# EAGLE design Adafruit Bluefruit LE UART Friend (EAGLE 6.4)
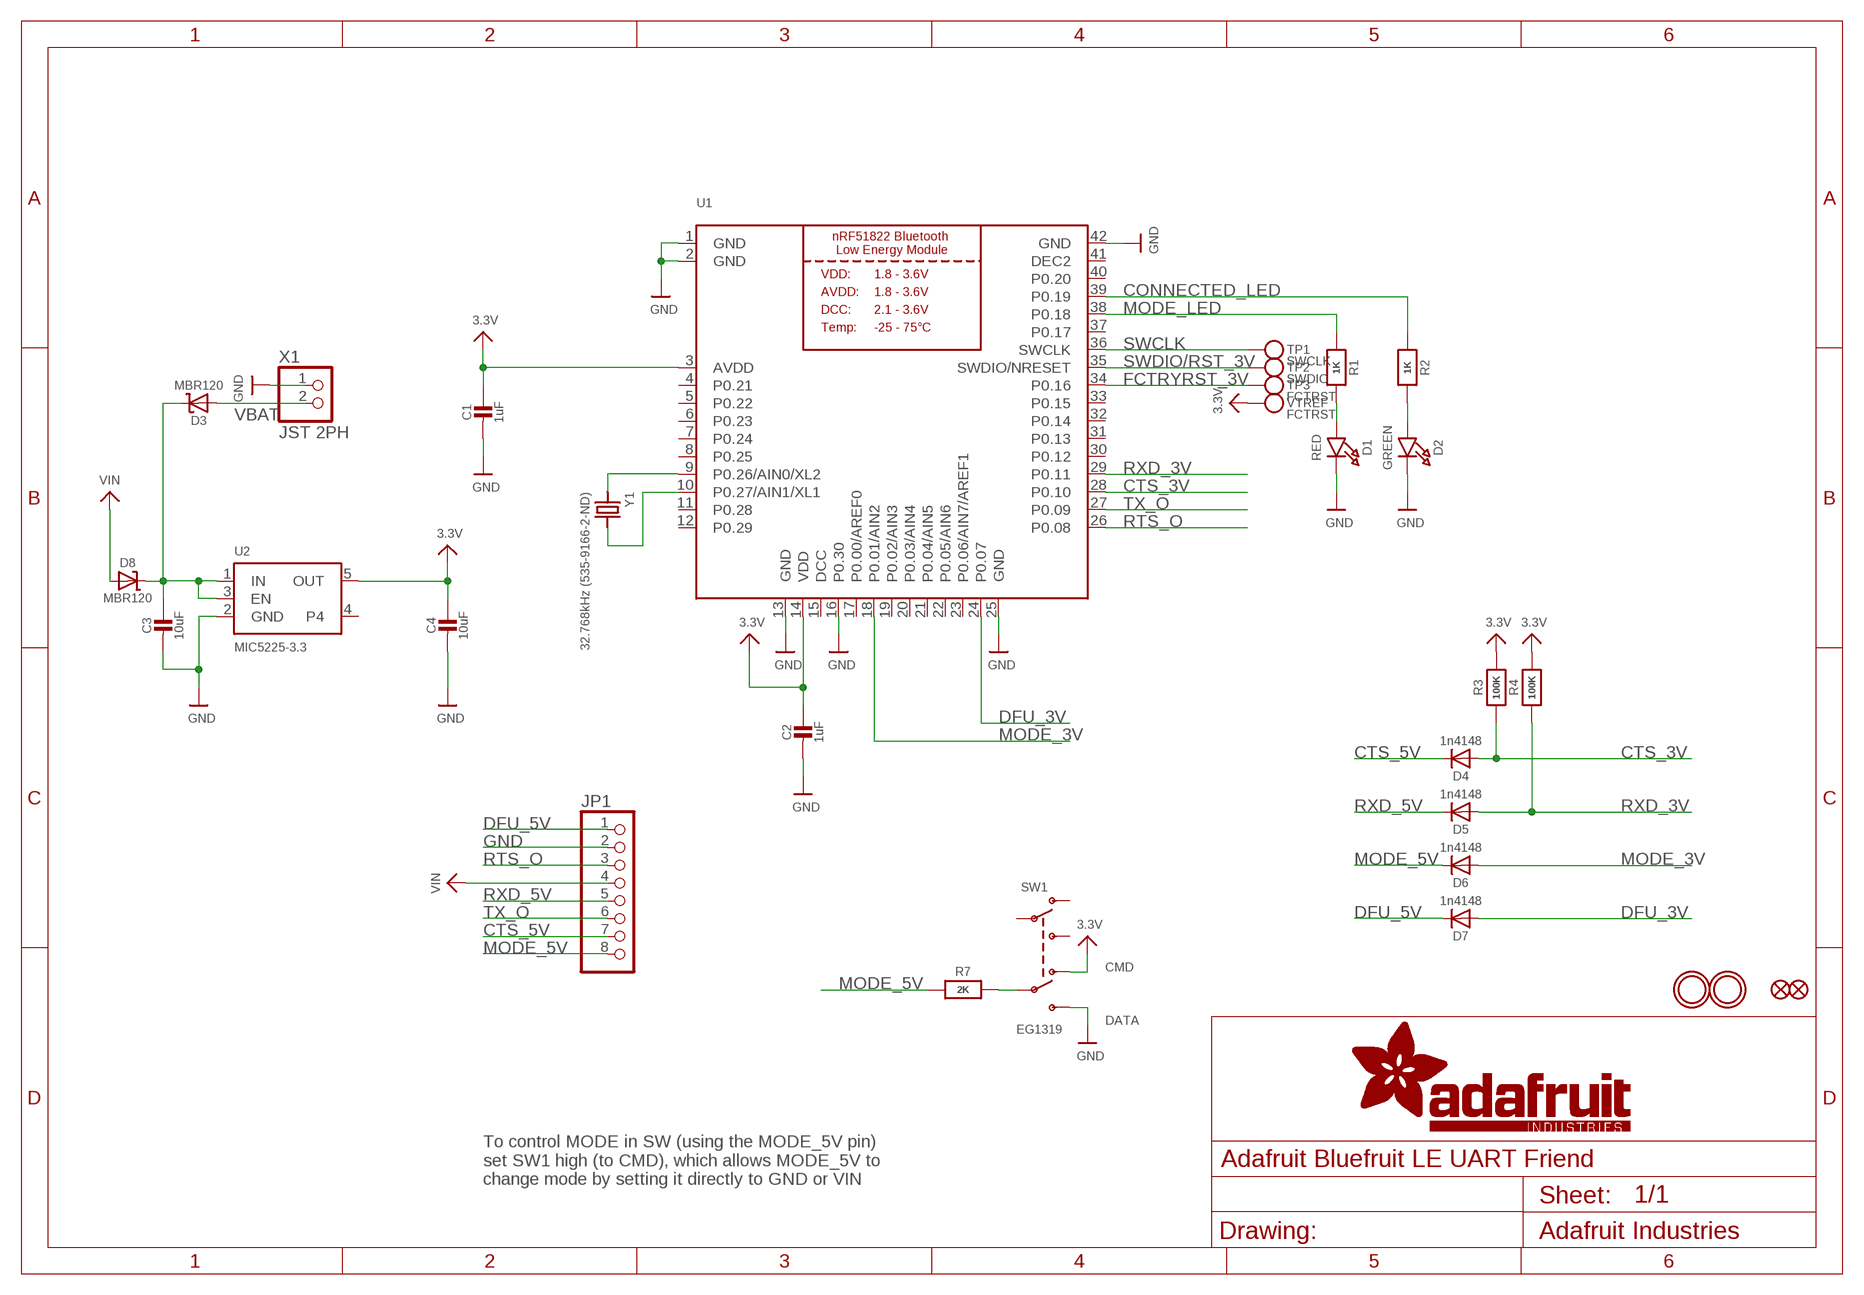
[diagram p0: schematic, sheet 1]

## Parts
C1  1uF  CAP_CERAMIC0805-NOOUTLINE  [0805-NO]
C2  1uF  CAP_CERAMIC0805-NOOUTLINE  [0805-NO]
C3  10uF  CAP_CERAMIC0805-NOOUTLINE  [0805-NO]
C4  10uF  CAP_CERAMIC0805-NOOUTLINE  [0805-NO]
D1  RED  LED0805_NOOUTLINE  [CHIPLED_0805_NOOUTLINE]
D2  GREEN  LED0805_NOOUTLINE  [CHIPLED_0805_NOOUTLINE]
D3  MBR120  DIODE-SCHOTTKYSOD-123  [SOD-123]
D4  1n4148  DIODESOD-323  [SOD-323]
D5  1n4148  DIODESOD-323  [SOD-323]
D6  1n4148  DIODESOD-323  [SOD-323]
D7  1n4148  DIODESOD-323  [SOD-323]
D8  MBR120  DIODE-SCHOTTKYSOD-123  [SOD-123]
FID1  FIDUCIAL""  [FIDUCIAL_1MM]
FID2  FIDUCIAL""  [FIDUCIAL_1MM]
JP1  HEADER-1X876MIL  [1X08_ROUND_76]
R1  1K  RESISTOR0805_NOOUTLINE  [0805-NO]
R2  1K  RESISTOR0805_NOOUTLINE  [0805-NO]
R3  100K  RESISTOR0805_NOOUTLINE  [0805-NO]
R4  100K  RESISTOR0805_NOOUTLINE  [0805-NO]
R7  2K  RESISTOR0805_NOOUTLINE  [0805-NO]
SW1  EG1319  SWITCH_DPDTEG1390  [EG1390]
TP1  SWCLK  TESTPOINT1.5X2.0MM_NOCREAM  [PAD-1.5X2.0]
TP2  SWDIO  TESTPOINT1.5X2.0MM_NOCREAM  [PAD-1.5X2.0]
TP3  FCTRST  TESTPOINT1.5X2.0MM_NOCREAM  [PAD-1.5X2.0]
U1  NRF51822_MODULE_MDBT40  [BLE_MODULE_RAYTAC_MDBT40]
U2  MIC5225-3.3  VREG_SOT23-5  [SOT23-5]
U$28  MOUNTINGHOLE2.5  [MOUNTINGHOLE_2.5_PLATED]
U$29  MOUNTINGHOLE2.5  [MOUNTINGHOLE_2.5_PLATED]
VTREF  FCTRST  TESTPOINT1.5X2.0MM_NOCREAM  [PAD-1.5X2.0]
X1  JST 2PH  CON_JST_PH_2PIN  [JSTPH2]
Y1  32.768kHz (535-9166-2-ND)  CRYSTAL2.0X6.0_32.768  [CRYSTAL_CYL_2X6MM_SMT]

## Nets
3.3V: C1.1 C2.1 C4.1 R3.2 R4.2 SW1.O2 U1.3(AVDD) U1.14(VDD) U2.5(OUT) VTREF.P$1
CONNECTED_LED: R2.1 U1.39(P0.19)
CTS_3V: D4.A R3.1 U1.28(P0.10)
CTS_5V: D4.C JP1.7
DFU_3V: D7.A U1.24(P0.07)
DFU_5V: D7.C JP1.1
FCTRYRST_3V: TP3.P$1 U1.34(P0.16)
GND: C1.2 C2.2 C3.2 C4.2 D1.C D2.C JP1.2 SW1.S2 U1.1(GND) U1.2(GND) U1.13(GND) U1.16(P0.30) U1.25(GND) U1.42(GND) U2.2(GND) X1.1
MODE_3V: D6.A U1.18(P0.01/AIN2)
MODE_5V: D6.C JP1.8 R7.1
MODE_LED: R1.1 U1.38(P0.18)
N$1: U1.9(P0.26/AIN0/XL2) Y1.1
N$2: U1.10(P0.27/AIN1/XL1) Y1.2
N$3: C3.1 D3.C D8.C U2.1(IN) U2.3(EN)
N$4: R7.2 SW1.P2
N$5: D1.A R1.2
N$6: D2.A R2.2
RTS_O: JP1.3 U1.26(P0.08)
RXD_3V: D5.A R4.1 U1.29(P0.11)
RXD_5V: D5.C JP1.5
SWCLK: TP1.P$1 U1.36(SWCLK)
SWDIO/RST_3V: TP2.P$1 U1.35(SWDIO/NRESET)
TX_O: JP1.6 U1.27(P0.09)
VBAT: D3.A X1.2
VIN: D8.A JP1.4
Unconnected: SW1.O1 SW1.P1 SW1.S1 U1.4(P0.21) U1.5(P0.22) U1.6(P0.23) U1.7(P0.24) U1.8(P0.25) U1.11(P0.28) U1.12(P0.29) U1.17(P0.00/AREF0) U1.19(P0.02/AIN3) U1.20(P0.03/AIN4) U1.21(P0.04/AIN5) U1.22(P0.05/AIN6) U1.23(P0.06/AIN7/AREF1) U1.30(P0.12) U1.31(P0.13) U1.32(P0.14) U1.33(P0.15) U1.37(P0.17) U1.40(P0.20) U2.4

## Notes on the sheet
- CMD
- DATA
- To control MODE in SW (using the MODE_5V pin)
  set SW1 high (to CMD), which allows MODE_5V to
  change mode by setting it directly to GND or VIN

## Power pins joined to a net without a drawn wire
DCC: U1.15(DCC)
DEC2: U1.41(DEC2)

## Library data of the parts
C1-C4 = microbuilder:CAP_CERAMIC: Ceramic Capacitors For new designs, use the packages preceded by an '_' character since they are more reliable: The following footprints should be used on most boards: _0402 - Standard footprint for regular board layouts _0603 - Standard footprint for regular board layouts _0805 - Standard footprint for regular board layouts _1206 - Standard footprint for regular board layouts For extremely tight-pitch boards where space is at a premium, the following 'micro-pitch' footprints can be used (smaller pads, no silkscreen outline, etc.): _0402MP - Micro-pitch footprint for very dense/compact boards _0603MP - Micro-pitch footprint for very dense/compact boards _0805MP - Micro-pitch footprint for very dense/compact boards _1206MP - Micro-pitch footprint for very dense/compact boards
D1 D2 = microbuilder:LED: LED 0603 - 0603 Surface Mount Package 2mA: Green LED - Low Power (3.9mcd, 2ma, 1.7Vf) - Digikey: 475-2709-2-ND Orange LED - Low Power (9.8mcd, 2ma, 1.8Vf) - Digikey: 475-1194-2-ND Red LED - Low Power (5mcd, 2ma, 1.8Vf) - Digikey: 475-1195-2-ND Yellow LED - Low Power (7mcd, 2ma, 1.8Vf) - Digikey: 475-1196-2-ND 5mA: Blue LED - Low Power (17mcd, 5ma, 2.9Vf) - Digikey: LNJ937W8CRACT-ND 0805 - 0805 Surface Mount Package 2mA: Red LED (8.8mcd, 2mA, 1.8Vf, Clear) - Low Power [Digikey: 475-2510-1-ND] Green LED (5mcd, 2mA, 1.8Vf, Clear) - Low Power [Digikey: 475-2730-1-ND] Yellow LED (11.3mcd, 2mA, 1.8Vf, Clear) - Low Power [Digikey: 475-2555-1-ND] 20mA: Red LED (104mcd, 20mA, Diffused) - LS R976 [Digikey: 475-1278-6-ND] Red LED (12mcd, 20mA, 2.0Vf, Clear) - APT2012EC [Digikey: 754-1128-1-ND] Green LED (15mcd, 20mA, 2.2Vf, Clear) - APT2012GC [Digikey: 754-1131-1-ND] Orange LED (160mcd, 20mA, 2.1Vf, Clear) - APT2012SECK [Digikey: 754-1130-1-ND] 1206 - 1206 Surface Mount Package Green LED (26mcd, 20mA, Diffused) - LG N971 [Digikey: 475-1407-6-ND] Red LED (15mcd, 20mA, Diffused) - LH N974 [Digikey: 475-1416-6-ND] Cree - Cree High-Power Surface Mount LEDs XPEBWT-L1-0000-00D50 - White 111lm 350mA 2.9Vf 6200K 110° XTEAWT-00-0000-00000LEE3 - White 114lm 350mA 2.85Vf 5000K 115° Everlight - Everlight 45-21 Series Surface Mount LEDs 45-21/QK2C-B2832AC2CB2/2T - Warm White 2000mcd 20mA 3.25Vf 3050K 120° 45-21/LK2C-B38452C4CB2/2T - Nuetral White 2000mcd 20mA 3.25Vf 4150K 120° 45-21/LK2C-B50634C6CB2/2T - Cold White 2200mcd 20mA 3.25Vf 5650K 120° PLCC2 Reverse Mount LS T77K-J1L2-1-0-2-R18-Z - Red 11.25mcd 2mA 1.8Vf 630nm 120° LO T77K-L1M2-24-Z - Orange 19.6mcd 2mA 1.8Vf 606nm 120° LY T77K-K2M1-26-Z - Yellow 15.7mcd 2mA 1.8Vf 587nm 120°
D3 D8 = microbuilder:DIODE-SCHOTTKY
D4-D7 = microbuilder:DIODE: Diode SMA Model Volts Amps Type Vf Ir Digikey # Notes SSA34-E3 40V 3A Schottky 480mV @ 3A 200uA @ 40V SSA34-E3/61TGITR-ND CDBA120-G 20V 1A Schottky 500mV @ 1A 500uA @ 20V 641-1014-6-ND REEL MBRA210 10V 2A Schottky 350mV @ 2A 700uA @ 10V MBRA210LT3 SOD-123 Model Volts Amps Type Vf Ir Order # Notes BAT54T1G 30V 200mA Schottky 800mV @ 200mA 2uA @ 25V BAT54T1GOSTR-ND B0530W 30V 500mA Schottky 430mV @ 500mA 130uA @ 30V B0530W-FDICT-ND REEL MBR120 20V 1A Schottky 340mV @ 1A MBR120VLSFT1GOSCT-ND SOD-323 Model Volts Amps Type Vf Ir Order # Notes PMEG2005EJ 20V 500mA Schottky 355mV @ 500mA 568-4110-1-ND ZLLS410 10V 570mA Schottky 380mV @ 570mA ZLLS410CT-ND 1N4148WS 75V 150mA Silicon/Simple 1V 1N4148WSFSCT-ND REEL SOD-523 Model Volts Amps Type Vf Ir Order # Notes BAT54XV2 30V 200mA Schottky 0.8V @ 100mA BAT54XV2CT-ND TB751S 30V 30mA Schottky RB751S-40TE61CT-ND SOT23-R/W (R = Solder Paste/Reflow Ovens, W = Hand-Soldering) Model Volts Amps Type Vf Ir Order # Notes BAT54FILM 40V 300mA Schottky 497-7162-1-ND POWERDI-5 Model Volts Amps Type Vf Ir Order # Notes PDS560 60V 5A Schottky 670mV @ 5A 150uA @ 60V PDS560DICT-ND
FID1 FID2 = microbuilder:FIDUCIAL: Fiducial Alignment Points Various fiducial points for machine vision alignment.; BOM: EXCLUDE
JP1 = microbuilder:HEADER-1X8: PIN HEADER
R1-R4 R7 = microbuilder:RESISTOR: Resistors For new designs, use the packages preceded by an '_' character since they are more reliable: The following footprints should be used on most boards: _0402 - Standard footprint for regular board layouts _0603 - Standard footprint for regular board layouts _0805 - Standard footprint for regular board layouts _1206 - Standard footprint for regular board layouts For extremely tight-pitch boards where space is at a premium, the following 'micro-pitch' footprints can be used (smaller pads, no silkscreen outline, etc.): _0402MP - Micro-pitch footprint for very dense/compact boards _0603MP - Micro-pitch footprint for very dense/compact boards _0805MP - Micro-pitch footprint for very dense/compact boards _1206MP - Micro-pitch footprint for very dense/compact boards
SW1 = microbuilder:SWITCH_DPDT: Switch - DPDT A DPDT Switch acts like an SPDT switch, but has a pair of switches instead of just one. Vertical - 0.3A @ 6V SMT - Digikey: JS202011SCQN
TP1-TP3 VTREF = microbuilder:TESTPOINT: Test Point Various test points for characterisation and PCB testing TESTPOINT_SMT - Compact Surface Mount Test Point [Digikey: 5016KTR-ND]
U1 = microbuilder:NRF51822_MODULE_MDBT40: nRF51822 Bluetooth Low Energy Module
U2 = microbuilder:VREG_SOT23-5: SOT23-5 Fixed Voltage Regulators Part Current Out V Out V In V Dropout θJA (°C/W) TJ (°C) Digikey Part No. ADP121 150mA 3.3V 3.4-5.5V 0.09V @ 150mA -- -- ADP121-AUJZ33R7CT-ND ADP121 150mA 3.0V 3.1-5.5V 0.09V @ 150mA -- -- ADP121-AUJZ30R7CT-ND ADP122 300mA 3.3V 3.4-5.5V 0.085V @ 300mA -- -- ADP122AUJZ-3.3-R7CT-ND ADP1712 300mA 3.3V 3.5-5.5V 0.17V @ 300mA -- -- ADP1712AUJZ-3.3-R7TR-ND AP7311 (Low Cost) 150mA 3.3V 3.5-6V 0.15V @ 150mA -- -- AP7311-33WG-7DICT-ND LD39015M18R 150mA 1.8V 1.9V-5.5V 0.08V @ 100mA -- -- 497-6977-1-ND LP2985A-33DBVR 150mA 3.3V 3.3-16V 0.28V @ 150mA 206 150 296-18479-1-ND MCP1824T-3302E/OT 300mA 3.3V 3.5V-6V 0.2V @ 300mA -- -- MCP1824T-3302E/OTCT-ND MIC5205-2.5YM5 TR 150mA 2.5V 2.7-16V 0.165V @ 150mA -- -- 576-1257-2-ND MIC5205-3.0YM5 TR 150mA 3.0V 3.2V-16V 0.165V @ 150mA -- -- 576-1258-2-ND MIC5205-3.3YM5 TR 150mA 3.3V 3.5V-16V 0.165V @ 150mA -- -- 576-1259-2-ND TPS780330220 150mA 3.3V+2.2V 3.6-5.5V 250mV Max -- -- 296-23332-1-ND TDA3663/N1,135 100mA 3.3V 3.5-45V 0.18V @ 50mA -- -- 568-5343-1-ND Max operating temp can be calculated using θJA, TJ (max junction temperature), and power in watts. Set the "Maximum Ambient Temperature" until it reaches TJ ("Max Junction Temperature"), which is the absolute limit for safe use of the regulator: Heat Sink Temperature Calculator <http://www.daycounter.com/Calculators/Heat-Sink-Temperature-Calculator.phtml> For example, With 12V source into a 3.3V LP2985 and a 30mA load, we are dissipating (12V-3.3V) * 0.03A = 0.261W. With a θJA of 206 °C/W, a TJ of 150°C, and 261mW we can safely use the chip without a heat sink up to 75°C (=147.1°C Junction Temperature).
U$28 U$29 = microbuilder:MOUNTINGHOLE: Mounting Hole For #2 screws (0.086"/2.18mm width, 0.094"/2.4mm hole) use 2.5mm; BOM: EXCLUDE
X1 = microbuilder:CON_JST_PH_2PIN: JST 2-Pin Right-Angle Connector PH-Series - 4UConnector: 17311 SH-Series - 4UConnector: 07278
Y1 = microbuilder:CRYSTAL: Crystals HC49UP - Surface Mount Crystal 4.0MHz 18pF +/-30ppm Surface Mount Crystal [Digikey: 535-9857-1-ND] 12.0 MHz Surface Mount Crystal [Digikey: 535-9869-6-ND] 25.0 MHz Surface Mount Crystal [Digikey: 535-9078-1-ND] 2.5 x 2.0mm - MEMs SMT Crystal 16.0 MHz 10pF 20ppm 2.5 x 2.0mm Crystal [Digikey -40-85°C: 535-10923-1-ND] 3.2 x 2.5mm - MEMs SMT Crystal 12.0 MHz 8pF 15ppm 3.2 x 2.5mm Crystal [Digikey: -10-70°C: 644-1047-1-ND -40-125°C: 644-1128-1-ND] 40~85°C cheaper: 644-1173-6-ND 16.0 MHz 8pF 15ppm 3.2 x 2.5mm Crystal [Digikey: -10-70°C: 644-1049-1-ND -40-125°C: 644-1129-2-ND]-40~85°C cheaper: 644-1175-6-ND 16.0 MHz 10pF 10ppm 3.2 x 2.5mm Crystal [Digikey: 644-1100-1-ND] 27.12 MHz 18pF 30ppm 3.2 x 2.5mm Crystal [Digikey: 887-1424-1-ND] 27.12MHz 10pF 10ppm 3.2 x 2.5mm Crystal [Digikey: 887-1329-1-ND] 4.9 x 1.8mm - MEMs SMT Crystal 32.768 KHz 12.5pF 20ppm 4.9 x 1.8mm Crystal [Digikey: SE2415CT-ND] 8.0 x 3.8mm - Surface Mount Crystal 32.768kHz 12.5pF 20ppm -40°C-85°C [Digikey: 535-9166-2-ND] Cylinder 32.768KHz Cylinder Crystal (2x6mm body) [Ex. Digikey: 300-8341-2-ND]

## Board
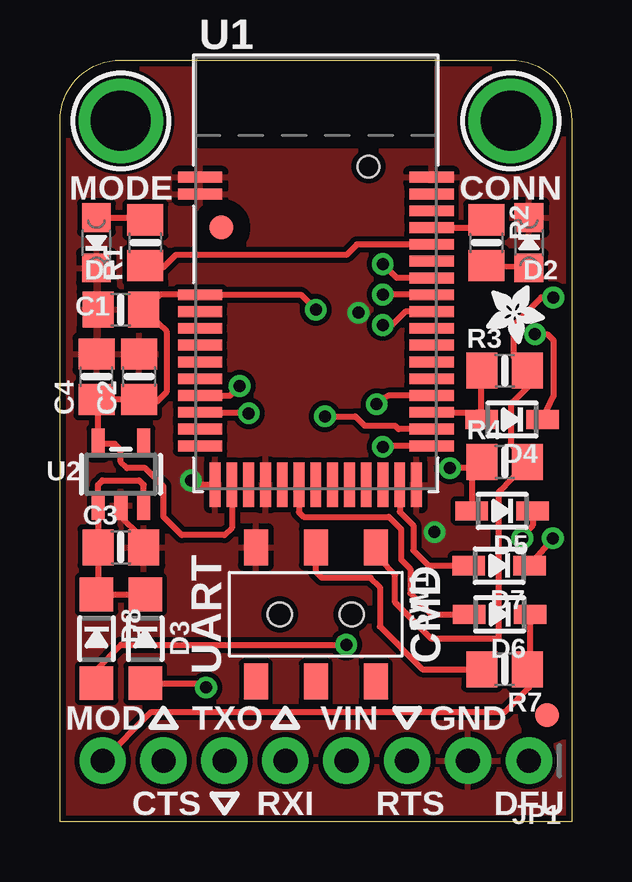
[diagram p1: board, top side]
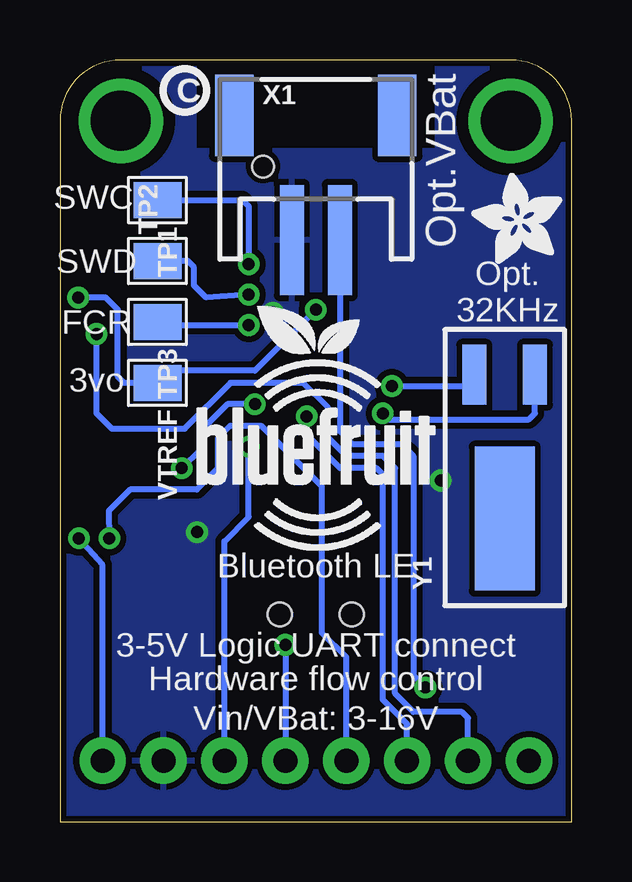
[diagram p2: board, bottom side, seen from below]

Size 21.34 x 31.75 mm. Coordinates in mm from the lower left corner, seen from the top.
Outline: 0,0 0,29.21 arc-90 2.54,31.75 18.8,31.75 arc-90 21.34,29.21 21.34,0 0,0
Copper layers (1*16): Top 0.035mm / dielectric 1.5mm / Bottom 0.035mm
Design rules "adafruit": minimum track width 8mil, minimum drill 15.5mil, track to track 8mil, track to pad 8mil, pad to pad 8mil, via to via 8mil, smd to smd 8mil, copper to edge 10mil, drill to drill 8mil, minimum pad ring 10mil, minimum via ring 8mil, stop-mask expansion 2mil, vias tented up to drill 20mil, thermal gap 10mil

### Footprints (pad centres in the part's own frame; a part is rotated, then mirrored left to right if it is on the bottom)
0805-NO = smd 1.3 x 1.5: 1 -0.95,0; 2 0.95,0
CHIPLED_0805_NOOUTLINE = smd 1.2 x 1.2: A 0,-1.05; C 0,1.05
SOD-123 = smd 1.4 x 1.4: A 1.85,0; C -1.85,0
SOD-323 = smd 1.35 x 0.8: A 1.27,0; C -1.27,0
FIDUCIAL_1MM = smd 1 x 1: 1 0,0
1X08_ROUND_76 = drill 1 pad 1.93: 1 -8.89,0; 2 -6.35,0; 3 -3.81,0; 4 -1.27,0; 5 1.27,0; 6 3.81,0; 7 6.35,0; 8 8.89,0
EG1390 = smd 1 x 1.5: O1 -2.5,2.8; O2 -2.5,-2.8; P1 0,2.8; P2 0,-2.8; S1 2.5,2.8; S2 2.5,-2.8 | hole 1: 1.5,0; -1.5,0
PAD-1.5X2.0 = smd 1.5 x 2: P$1 0,0
BLE_MODULE_RAYTAC_MDBT40 = smd 1.85 x 0.45: 1 -4.825,4; 2 -4.825,3.3; 3 -4.825,-0.9; 4 -4.825,-1.6; 5 -4.825,-2.3; 6 -4.825,-3; 7 -4.825,-3.7; 8 -4.825,-4.4; 9 -4.825,-5.1; 10 -4.825,-5.8; 11 -4.825,-6.5; 12 -4.825,-7.2; 26 4.825,-7.2; 27 4.825,-6.5; 28 4.825,-5.8; 29 4.825,-5.1; 30 4.825,-4.4; 31 4.825,-3.7; 32 4.825,-3; 33 4.825,-2.3; 34 4.825,-1.6; 35 4.825,-0.9; 36 4.825,-0.2; 37 4.825,0.5; 38 4.825,1.2; 39 4.825,1.9; 40 4.825,2.6; 41 4.825,3.3; 42 4.825,4 | smd 0.45 x 1.85: 13 -4.2,-8.825; 14 -3.5,-8.825; 15 -2.8,-8.825; 16 -2.1,-8.825; 17 -1.4,-8.825; 18 -0.7,-8.825; 19 0,-8.825; 20 0.7,-8.825; 21 1.4,-8.825; 22 2.1,-8.825; 23 2.8,-8.825; 24 3.5,-8.825; 25 4.2,-8.825 | hole 0.9: 2.2,4.45
SOT23-5 = smd 0.55 x 1.2: 1 -0.95,-1.3; 2 0,-1.3; 3 0.95,-1.3; 4 0.95,1.3; 5 -0.95,1.3
MOUNTINGHOLE_2.5_PLATED = drill 2.5 pad 3.2: P$1 0,0
JSTPH2 = smd 1 x 4.6: 1 -1,-3.7; 2 1,-3.7 | smd 1.6 x 3.4: NC1 -3.4,1.5; NC2 3.4,1.5
CRYSTAL_CYL_2X6MM_SMT = smd 2.5 x 1: 1 2.125,1.27; 2 2.125,-1.27 | smd 6 x 2.5: CYLINDER -3.875,0

### Placement (x,y rotation side)
C1  2.54,21.34 180 top
C2  3.3,18.54 90 top
C3  2.54,11.43 0 top
C4  1.52,18.54 90 top
D1  1.52,24.13 180 top
D2  19.56,24.13 0 top
D3  3.56,7.62 270 top
D4  18.85,16.76 180 top
D5  18.44,12.95 180 top
D6  18.34,8.64 180 top
D7  18.31,10.67 180 top
D8  1.52,7.62 270 top
FID1  20.32,4.45 0 top
FID2  6.73,24.77 0 top
JP1  10.67,2.54 180 top
R1  3.56,24.13 90 top
R2  17.78,24.13 270 top
R3  18.54,18.8 0 top
R4  18.54,14.99 0 top
R7  18.54,6.35 180 top
SW1  10.67,8.64 180 top
TP1  17.27,25.91 270 bottom
TP2  17.27,23.37 90 bottom
TP3  17.27,20.83 270 bottom
U1  10.67,22.86 0 top
U2  2.54,14.48 0 top
U$9  [BLUEFRUITLOGO_100MM]  15.62,11.3 0 bottom
U$24  [PCBFEAT-REV-040]  16.13,30.48 0 bottom
U$25  [ADAFRUIT_3.5MM]  0.38,23.24 90 bottom
U$26  [ADAFRUIT_2.5MM]  17.78,22.35 270 top
U$28  18.8,29.21 0 top
U$29  2.54,29.21 0 top
VTREF  17.27,18.29 270 bottom
X1  10.67,27.94 0 bottom
Y1  2.79,16.51 90 bottom

### Tracks (layer width: path | path; a pad name or v marks a point on that pad's centre or on a via)
3.3V  (via drill 0.5)
  Top 0.254: U1.14 7.17,12.25 6.86,11.94 5.08,11.94 4.32,12.7 4.32,13.97 3.56,14.73 2.79,14.73 2.54,14.99 2.54,15.49 2.29,15.75 1.62,15.75 U2.5 1.59,17.46 C4.1 C2.1 4.06,17.53 4.45,17.91 4.45,20.45 C1.1 4.18,21.96 U1.3 10.04,21.96 v10.67,21.34 | SW1.O2 13.16,11.05 13.34,10.92 13.97,10.29 13.97,9.14 15.49,7.62 18.29,7.62 18.29,13.72 18.41,13.84 R4.2 18.8,15.75 18.8,17.4 19.49,18.09 R3.2 18.92,19.36 18.92,20.7 20.07,21.84 v20.57,21.84
  Bottom 0.254: v10.67,21.34 13.21,18.8 16.76,18.8 VTREF.P$1 18.67,18.29 18.92,18.54 18.92,21.34 19.43,21.84 v20.57,21.84
CONNECTED_LED
  Top 0.254: U1.39 17.39,24.76 R2.1
CTS_3V
  Top 0.254: U1.28 17.36,17.06 D4.A 17.58,18.75 R3.1
CTS_5V  (via drill 0.5)
  Top 0.254: v19.81,20.32 20.32,20.32 20.57,20.07 20.57,17.73 D4.C
  Bottom 0.254: JP1.7 4.32,4.32 4.57,4.57 6.6,4.57 7.37,5.33 7.37,14.73 7.87,15.24 9.4,15.24 10.16,16 10.16,17.27 11.18,18.29 14.22,18.29 16.13,16.38 19.18,16.38 19.81,17.02 v19.81,20.32
DFU_3V
  Top 0.254: U1.24 14.17,12.91 14.73,12.34 14.73,11.3 15.37,10.67 D7.A 16.76,10.67 16.51,10.92
DFU_5V  (via drill 0.5)
  Top 0.254: D7.C v20.55,11.81
  Bottom 0.254: JP1.1 19.56,10.69 v20.55,11.81
FCTRYRST_3V  (via drill 0.5)
  Top 0.254: U1.34 14.4,21.26 13.84,20.7 v13.46,20.7
  Bottom 0.254: TP3.P$1 17.14,20.7 v13.46,20.7
GND  (via drill 0.5)
  Top 0.254: U1.13 5.65,14.04 v5.46,14.22 | U2.2 2.54,12.7 3.3,11.94 3.3,11.62 C3.2
  other vias: 15.62,12.06 12.45,21.21
  pour Bottom (isolate 0.254): 0,0 0,29.21 arc-90 2.54,31.75 5.59,31.75 5.59,27.94 15.75,27.94 15.75,31.75 18.8,31.75 arc-90 21.34,29.21 21.34,0
  pour Top (isolate 0.203): 0,0 0,29.21 arc-90 2.54,31.75 5.59,31.75 5.59,27.94 15.75,27.94 15.75,31.75 18.8,31.75 arc-90 21.34,29.21 21.34,0
MODE_3V
  Top 0.254: U1.18 9.97,12.89 10.16,12.7 13.72,12.7 14.22,12.19 14.22,10.92 14.61,10.54 14.61,9.53 15.49,8.64 D6.A
MODE_5V
  Top 0.254: 19.56,8.64 19.3,8.89 D6.C 19.61,6.66 R7.1 19.56,5.59 18.54,4.57 3.81,4.57 JP1.8
MODE_LED
  Top 0.254: U1.38 12.38,24.06 11.94,23.62 4.83,23.62 4.32,23.11 R1.1
N$1  (via drill 0.5)
  Top 0.254: U1.9 7.09,17.76 v7.49,18.16
  Bottom 0.254: v7.49,18.16 4.06,18.16 Y1.1
N$2  (via drill 0.5)
  Top 0.254: U1.10 7.83,17.06 v7.87,17.02
  Bottom 0.254: v7.87,17.02 7.62,16.76 1.78,16.76 1.52,17.02 Y1.2
N$3
  Top 0.254: C3.1 U2.1 1.59,14.04 1.78,14.22 3.3,14.22 3.49,14.04 U2.3 | C3.1 1.52,11.43 | C3.1 1.59,9.54 D8.C D3.C
N$4
  Top 0.254: SW1.P2 10.67,10.41 10.92,10.16 12.95,10.16 13.34,9.78 13.34,8.13 15.11,6.35 R7.2
N$5
  Top 0.254: D1.A 3.52,25.18 R1.2
N$6
  Top 0.254: R2.2 19.52,23.11 D2.A
RTS_O  (via drill 0.5)
  Top 0.254: U1.26 13.55,15.66 v13.46,15.62
  Bottom 0.254: JP1.3 14.48,11.68 13.46,12.7 v13.46,15.62
RXD_3V  (via drill 0.5)
  Top 0.254: U1.29 13.7,17.76 v13.21,17.4 | R4.1 17.17,14.63 | 17.17,14.63 D5.A | 17.17,14.63 17.07,14.73 v16.26,14.73
  Bottom 0.254: v13.21,17.4 14.35,17.4 15.49,16.26 15.49,15.49 v16.26,14.73
RXD_5V  (via drill 0.5)
  Top 0.254: D5.C 19.71,12.34 19.3,11.94 v19.28,11.81
  Bottom 0.254: JP1.5 9.4,6.86 10.41,7.87 10.41,13.97 12.95,16.51 14.22,16.51 14.73,16 14.73,14.73 15.62,13.84 18.41,13.84 19.3,12.95 v19.28,11.81
SWCLK  (via drill 0.5)
  Top 0.254: U1.36 14.04,22.66 v13.46,23.24
  Bottom 0.254: TP1.P$1 13.72,25.91 13.46,25.65 v13.46,23.24
SWDIO/RST_3V  (via drill 0.5)
  Top 0.254: U1.35 13.58,21.96 v13.46,21.97
  Bottom 0.254: v13.46,21.97 15.24,21.84 15.75,22.35 15.75,23.11 16,23.37 TP2.P$1
TX_O  (via drill 0.5)
  Top 0.254: U1.27 14.12,16.36 13.97,16.51 12.7,16.51 12.32,16.89 v11.05,16.89
  Bottom 0.254: JP1.6 6.86,4.06 7.87,5.08 7.87,14.48 8.13,14.73 9.65,14.73 11.05,16.13 v11.05,16.89
VBAT  (via drill 0.5)
  Top 0.254: D3.A 5.91,5.77 v6.1,5.59
  Bottom 0.254: X1.2 9.67,16.27 9.14,15.75 7.11,15.75 6.6,15.24 6.6,6.1 v6.1,5.59
VIN  (via drill 0.5)
  Top 0.254: 11.68,7.62 v11.94,7.37 2.54,7.37 1.52,6.35 D8.A
  Bottom 0.254: v11.94,7.37 JP1.4

### Text on the board
tPlace: MODE | CONN | UART | CMD | MOD | TXO | VIN | GND | CTS | RXI | RTS | DFU
bPlace: Opt.VBat | SWC | SWD | Opt. / 32KHz | FCR | 3vo | Bluetooth LE | 3-5V Logic UART connect | Hardware flow control | Vin/VBat: 3-16V